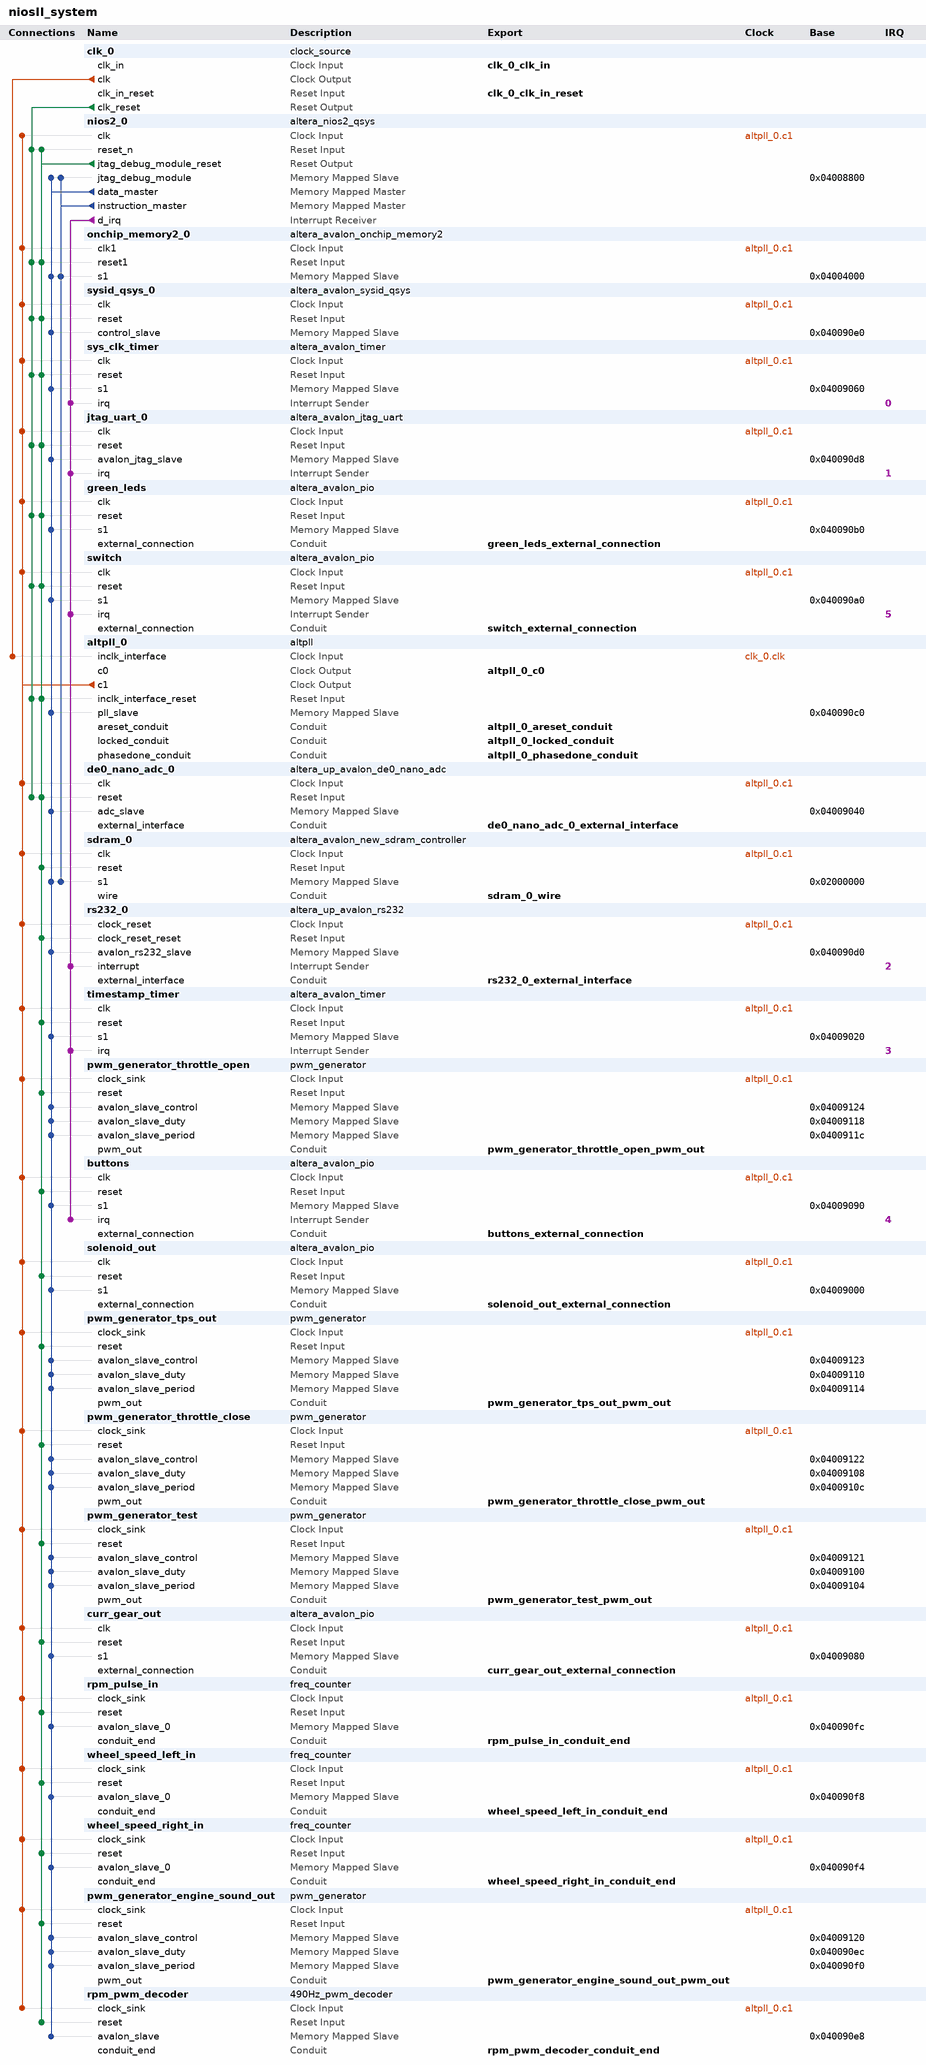
[diagram p0: system contents]
# Platform Designer (Qsys) system niosII_system, Cyclone IV E EP4CE22F17C7
# Parameters at their usual value, and those the tool derives, are not listed.
package require -exact qsys 12.1
create_system niosII_system
set_project_property DEVICE_FAMILY {Cyclone IV E}
set_project_property DEVICE EP4CE22F17C7

add_instance clk_0 clock_source 12.1
set_instance_parameter_value clk_0 clockFrequency 50000000

add_instance nios2_0 altera_nios2_qsys 12.1
set_instance_parameter_value nios2_0 resetSlave onchip_memory2_0.s1
set_instance_parameter_value nios2_0 exceptionSlave onchip_memory2_0.s1
set_instance_parameter_value nios2_0 breakSlave nios2_0.jtag_debug_module
set_instance_parameter_value nios2_0 impl Tiny
set_instance_parameter_value nios2_0 icache_size 4096

add_instance onchip_memory2_0 altera_avalon_onchip_memory2 12.1
set_instance_parameter_value onchip_memory2_0 dataWidth 32
set_instance_parameter_value onchip_memory2_0 dualPort false
set_instance_parameter_value onchip_memory2_0 initMemContent true
set_instance_parameter_value onchip_memory2_0 initializationFileName onchip_memory2_0
set_instance_parameter_value onchip_memory2_0 memorySize 16384

add_instance sysid_qsys_0 altera_avalon_sysid_qsys 12.1
set_instance_parameter_value sysid_qsys_0 id 0

add_instance sys_clk_timer altera_avalon_timer 12.1
set_instance_parameter_value sys_clk_timer period 1
set_instance_parameter_value sys_clk_timer periodUnits MSEC
set_instance_parameter_value sys_clk_timer timerPreset CUSTOM

add_instance jtag_uart_0 altera_avalon_jtag_uart 12.1
set_instance_parameter_value jtag_uart_0 simInteractiveOptions INTERACTIVE_INPUT_OUTPUT

add_instance green_leds altera_avalon_pio 12.1
set_instance_parameter_value green_leds direction Output
set_instance_parameter_value green_leds width 8

add_instance switch altera_avalon_pio 12.1
set_instance_parameter_value switch bitClearingEdgeCapReg true
set_instance_parameter_value switch captureEdge true
set_instance_parameter_value switch direction Input
set_instance_parameter_value switch generateIRQ true
set_instance_parameter_value switch irqType EDGE
set_instance_parameter_value switch width 4

add_instance altpll_0 altpll 12.1
set_instance_parameter_value altpll_0 INCLK0_INPUT_FREQUENCY 20000
set_instance_parameter_value altpll_0 GATE_LOCK_SIGNAL NO
set_instance_parameter_value altpll_0 VALID_LOCK_MULTIPLIER 1
set_instance_parameter_value altpll_0 INVALID_LOCK_MULTIPLIER 5
set_instance_parameter_value altpll_0 CLK0_MULTIPLY_BY 1
set_instance_parameter_value altpll_0 CLK1_MULTIPLY_BY 1
set_instance_parameter_value altpll_0 CLK0_DIVIDE_BY 1
set_instance_parameter_value altpll_0 CLK1_DIVIDE_BY 1
set_instance_parameter_value altpll_0 CLK0_PHASE_SHIFT -3000
set_instance_parameter_value altpll_0 CLK1_PHASE_SHIFT 0
set_instance_parameter_value altpll_0 CLK1_DUTY_CYCLE 50
set_instance_parameter_value altpll_0 PORT_clk1 PORT_USED
set_instance_parameter_value altpll_0 PORT_clk2 PORT_UNUSED
set_instance_parameter_value altpll_0 PORT_clk3 PORT_UNUSED
set_instance_parameter_value altpll_0 PORT_ARESET PORT_UNUSED
set_instance_parameter_value altpll_0 PORT_LOCKED PORT_UNUSED

add_instance de0_nano_adc_0 altera_up_avalon_de0_nano_adc 12.0
set_instance_parameter_value de0_nano_adc_0 sclk_freq 3.2
set_instance_parameter_value de0_nano_adc_0 numch 4

add_instance sdram_0 altera_avalon_new_sdram_controller 12.1
set_instance_parameter_value sdram_0 TAC 5.5
set_instance_parameter_value sdram_0 TRCD 20.0
set_instance_parameter_value sdram_0 TRP 20.0
set_instance_parameter_value sdram_0 casLatency 3
set_instance_parameter_value sdram_0 columnWidth 9
set_instance_parameter_value sdram_0 dataWidth 16
set_instance_parameter_value sdram_0 generateSimulationModel false
set_instance_parameter_value sdram_0 model custom
set_instance_parameter_value sdram_0 numberOfBanks 4
set_instance_parameter_value sdram_0 numberOfChipSelects 1
set_instance_parameter_value sdram_0 powerUpDelay 100.0
set_instance_parameter_value sdram_0 refreshPeriod 15.625
set_instance_parameter_value sdram_0 rowWidth 13

add_instance rs232_0 altera_up_avalon_rs232 12.0
set_instance_parameter_value rs232_0 baud 115200
set_instance_parameter_value rs232_0 parity None

add_instance timestamp_timer altera_avalon_timer 12.1
set_instance_parameter_value timestamp_timer period 1
set_instance_parameter_value timestamp_timer periodUnits USEC
set_instance_parameter_value timestamp_timer timerPreset CUSTOM

add_instance pwm_generator_throttle_open pwm_generator 1.0

add_instance buttons altera_avalon_pio 12.1
set_instance_parameter_value buttons captureEdge true
set_instance_parameter_value buttons direction Input
set_instance_parameter_value buttons edgeType FALLING
set_instance_parameter_value buttons generateIRQ true
set_instance_parameter_value buttons irqType EDGE
set_instance_parameter_value buttons width 8

add_instance solenoid_out altera_avalon_pio 12.1
set_instance_parameter_value solenoid_out bitModifyingOutReg true
set_instance_parameter_value solenoid_out direction Output
set_instance_parameter_value solenoid_out width 8

add_instance pwm_generator_tps_out pwm_generator 1.0

add_instance pwm_generator_throttle_close pwm_generator 1.0

add_instance pwm_generator_test pwm_generator 1.0

add_instance curr_gear_out altera_avalon_pio 12.1
set_instance_parameter_value curr_gear_out direction Output
set_instance_parameter_value curr_gear_out width 8

add_instance rpm_pulse_in freq_counter 1.0

add_instance wheel_speed_left_in freq_counter 1.0

add_instance wheel_speed_right_in freq_counter 1.0

add_instance pwm_generator_engine_sound_out pwm_generator 1.0

add_instance rpm_pwm_decoder 490Hz_pwm_decoder 1.0

# connections
add_connection altpll_0.c1 buttons.clk clock
add_connection altpll_0.c1 curr_gear_out.clk clock
add_connection altpll_0.c1 de0_nano_adc_0.clk clock
add_connection altpll_0.c1 green_leds.clk clock
add_connection altpll_0.c1 jtag_uart_0.clk clock
add_connection altpll_0.c1 nios2_0.clk clock
add_connection altpll_0.c1 onchip_memory2_0.clk1 clock
add_connection altpll_0.c1 pwm_generator_engine_sound_out.clock_sink clock
add_connection altpll_0.c1 pwm_generator_test.clock_sink clock
add_connection altpll_0.c1 pwm_generator_throttle_close.clock_sink clock
add_connection altpll_0.c1 pwm_generator_throttle_open.clock_sink clock
add_connection altpll_0.c1 pwm_generator_tps_out.clock_sink clock
add_connection altpll_0.c1 rpm_pulse_in.clock_sink clock
add_connection altpll_0.c1 rpm_pwm_decoder.clock_sink clock
add_connection altpll_0.c1 rs232_0.clock_reset clock
add_connection altpll_0.c1 sdram_0.clk clock
add_connection altpll_0.c1 solenoid_out.clk clock
add_connection altpll_0.c1 switch.clk clock
add_connection altpll_0.c1 sys_clk_timer.clk clock
add_connection altpll_0.c1 sysid_qsys_0.clk clock
add_connection altpll_0.c1 timestamp_timer.clk clock
add_connection altpll_0.c1 wheel_speed_left_in.clock_sink clock
add_connection altpll_0.c1 wheel_speed_right_in.clock_sink clock
add_connection clk_0.clk altpll_0.inclk_interface clock
add_connection clk_0.clk_reset altpll_0.inclk_interface_reset reset
add_connection clk_0.clk_reset de0_nano_adc_0.reset reset
add_connection clk_0.clk_reset green_leds.reset reset
add_connection clk_0.clk_reset jtag_uart_0.reset reset
add_connection clk_0.clk_reset nios2_0.reset_n reset
add_connection clk_0.clk_reset onchip_memory2_0.reset1 reset
add_connection clk_0.clk_reset switch.reset reset
add_connection clk_0.clk_reset sys_clk_timer.reset reset
add_connection clk_0.clk_reset sysid_qsys_0.reset reset
add_connection nios2_0.jtag_debug_module_reset altpll_0.inclk_interface_reset reset
add_connection nios2_0.jtag_debug_module_reset buttons.reset reset
add_connection nios2_0.jtag_debug_module_reset curr_gear_out.reset reset
add_connection nios2_0.jtag_debug_module_reset de0_nano_adc_0.reset reset
add_connection nios2_0.jtag_debug_module_reset green_leds.reset reset
add_connection nios2_0.jtag_debug_module_reset jtag_uart_0.reset reset
add_connection nios2_0.jtag_debug_module_reset nios2_0.reset_n reset
add_connection nios2_0.jtag_debug_module_reset onchip_memory2_0.reset1 reset
add_connection nios2_0.jtag_debug_module_reset pwm_generator_engine_sound_out.reset reset
add_connection nios2_0.jtag_debug_module_reset pwm_generator_test.reset reset
add_connection nios2_0.jtag_debug_module_reset pwm_generator_throttle_close.reset reset
add_connection nios2_0.jtag_debug_module_reset pwm_generator_throttle_open.reset reset
add_connection nios2_0.jtag_debug_module_reset pwm_generator_tps_out.reset reset
add_connection nios2_0.jtag_debug_module_reset rpm_pulse_in.reset reset
add_connection nios2_0.jtag_debug_module_reset rpm_pwm_decoder.reset reset
add_connection nios2_0.jtag_debug_module_reset rs232_0.clock_reset_reset reset
add_connection nios2_0.jtag_debug_module_reset sdram_0.reset reset
add_connection nios2_0.jtag_debug_module_reset solenoid_out.reset reset
add_connection nios2_0.jtag_debug_module_reset switch.reset reset
add_connection nios2_0.jtag_debug_module_reset sys_clk_timer.reset reset
add_connection nios2_0.jtag_debug_module_reset sysid_qsys_0.reset reset
add_connection nios2_0.jtag_debug_module_reset timestamp_timer.reset reset
add_connection nios2_0.jtag_debug_module_reset wheel_speed_left_in.reset reset
add_connection nios2_0.jtag_debug_module_reset wheel_speed_right_in.reset reset
add_connection nios2_0.data_master altpll_0.pll_slave avalon
set_connection_parameter_value nios2_0.data_master/altpll_0.pll_slave baseAddress 0x040090c0
add_connection nios2_0.data_master buttons.s1 avalon
set_connection_parameter_value nios2_0.data_master/buttons.s1 baseAddress 0x04009090
add_connection nios2_0.data_master curr_gear_out.s1 avalon
set_connection_parameter_value nios2_0.data_master/curr_gear_out.s1 baseAddress 0x04009080
add_connection nios2_0.data_master de0_nano_adc_0.adc_slave avalon
set_connection_parameter_value nios2_0.data_master/de0_nano_adc_0.adc_slave baseAddress 0x04009040
add_connection nios2_0.data_master green_leds.s1 avalon
set_connection_parameter_value nios2_0.data_master/green_leds.s1 baseAddress 0x040090b0
add_connection nios2_0.data_master jtag_uart_0.avalon_jtag_slave avalon
set_connection_parameter_value nios2_0.data_master/jtag_uart_0.avalon_jtag_slave baseAddress 0x040090d8
add_connection nios2_0.data_master nios2_0.jtag_debug_module avalon
set_connection_parameter_value nios2_0.data_master/nios2_0.jtag_debug_module baseAddress 0x04008800
add_connection nios2_0.data_master onchip_memory2_0.s1 avalon
set_connection_parameter_value nios2_0.data_master/onchip_memory2_0.s1 baseAddress 0x04004000
add_connection nios2_0.data_master pwm_generator_engine_sound_out.avalon_slave_control avalon
set_connection_parameter_value nios2_0.data_master/pwm_generator_engine_sound_out.avalon_slave_control baseAddress 0x04009120
add_connection nios2_0.data_master pwm_generator_engine_sound_out.avalon_slave_duty avalon
set_connection_parameter_value nios2_0.data_master/pwm_generator_engine_sound_out.avalon_slave_duty baseAddress 0x040090ec
add_connection nios2_0.data_master pwm_generator_engine_sound_out.avalon_slave_period avalon
set_connection_parameter_value nios2_0.data_master/pwm_generator_engine_sound_out.avalon_slave_period baseAddress 0x040090f0
add_connection nios2_0.data_master pwm_generator_test.avalon_slave_control avalon
set_connection_parameter_value nios2_0.data_master/pwm_generator_test.avalon_slave_control baseAddress 0x04009121
add_connection nios2_0.data_master pwm_generator_test.avalon_slave_duty avalon
set_connection_parameter_value nios2_0.data_master/pwm_generator_test.avalon_slave_duty baseAddress 0x04009100
add_connection nios2_0.data_master pwm_generator_test.avalon_slave_period avalon
set_connection_parameter_value nios2_0.data_master/pwm_generator_test.avalon_slave_period baseAddress 0x04009104
add_connection nios2_0.data_master pwm_generator_throttle_close.avalon_slave_control avalon
set_connection_parameter_value nios2_0.data_master/pwm_generator_throttle_close.avalon_slave_control baseAddress 0x04009122
add_connection nios2_0.data_master pwm_generator_throttle_close.avalon_slave_duty avalon
set_connection_parameter_value nios2_0.data_master/pwm_generator_throttle_close.avalon_slave_duty baseAddress 0x04009108
add_connection nios2_0.data_master pwm_generator_throttle_close.avalon_slave_period avalon
set_connection_parameter_value nios2_0.data_master/pwm_generator_throttle_close.avalon_slave_period baseAddress 0x0400910c
add_connection nios2_0.data_master pwm_generator_throttle_open.avalon_slave_control avalon
set_connection_parameter_value nios2_0.data_master/pwm_generator_throttle_open.avalon_slave_control baseAddress 0x04009124
add_connection nios2_0.data_master pwm_generator_throttle_open.avalon_slave_duty avalon
set_connection_parameter_value nios2_0.data_master/pwm_generator_throttle_open.avalon_slave_duty baseAddress 0x04009118
add_connection nios2_0.data_master pwm_generator_throttle_open.avalon_slave_period avalon
set_connection_parameter_value nios2_0.data_master/pwm_generator_throttle_open.avalon_slave_period baseAddress 0x0400911c
add_connection nios2_0.data_master pwm_generator_tps_out.avalon_slave_control avalon
set_connection_parameter_value nios2_0.data_master/pwm_generator_tps_out.avalon_slave_control baseAddress 0x04009123
add_connection nios2_0.data_master pwm_generator_tps_out.avalon_slave_duty avalon
set_connection_parameter_value nios2_0.data_master/pwm_generator_tps_out.avalon_slave_duty baseAddress 0x04009110
add_connection nios2_0.data_master pwm_generator_tps_out.avalon_slave_period avalon
set_connection_parameter_value nios2_0.data_master/pwm_generator_tps_out.avalon_slave_period baseAddress 0x04009114
add_connection nios2_0.data_master rpm_pulse_in.avalon_slave_0 avalon
set_connection_parameter_value nios2_0.data_master/rpm_pulse_in.avalon_slave_0 baseAddress 0x040090fc
add_connection nios2_0.data_master rpm_pwm_decoder.avalon_slave avalon
set_connection_parameter_value nios2_0.data_master/rpm_pwm_decoder.avalon_slave baseAddress 0x040090e8
add_connection nios2_0.data_master rs232_0.avalon_rs232_slave avalon
set_connection_parameter_value nios2_0.data_master/rs232_0.avalon_rs232_slave baseAddress 0x040090d0
add_connection nios2_0.data_master sdram_0.s1 avalon
set_connection_parameter_value nios2_0.data_master/sdram_0.s1 baseAddress 0x02000000
add_connection nios2_0.data_master solenoid_out.s1 avalon
set_connection_parameter_value nios2_0.data_master/solenoid_out.s1 baseAddress 0x04009000
add_connection nios2_0.data_master switch.s1 avalon
set_connection_parameter_value nios2_0.data_master/switch.s1 baseAddress 0x040090a0
add_connection nios2_0.data_master sys_clk_timer.s1 avalon
set_connection_parameter_value nios2_0.data_master/sys_clk_timer.s1 baseAddress 0x04009060
add_connection nios2_0.data_master sysid_qsys_0.control_slave avalon
set_connection_parameter_value nios2_0.data_master/sysid_qsys_0.control_slave baseAddress 0x040090e0
add_connection nios2_0.data_master timestamp_timer.s1 avalon
set_connection_parameter_value nios2_0.data_master/timestamp_timer.s1 baseAddress 0x04009020
add_connection nios2_0.data_master wheel_speed_left_in.avalon_slave_0 avalon
set_connection_parameter_value nios2_0.data_master/wheel_speed_left_in.avalon_slave_0 baseAddress 0x040090f8
add_connection nios2_0.data_master wheel_speed_right_in.avalon_slave_0 avalon
set_connection_parameter_value nios2_0.data_master/wheel_speed_right_in.avalon_slave_0 baseAddress 0x040090f4
add_connection nios2_0.instruction_master nios2_0.jtag_debug_module avalon
set_connection_parameter_value nios2_0.instruction_master/nios2_0.jtag_debug_module baseAddress 0x04008800
add_connection nios2_0.instruction_master onchip_memory2_0.s1 avalon
set_connection_parameter_value nios2_0.instruction_master/onchip_memory2_0.s1 baseAddress 0x04004000
add_connection nios2_0.instruction_master sdram_0.s1 avalon
set_connection_parameter_value nios2_0.instruction_master/sdram_0.s1 baseAddress 0x02000000
add_connection nios2_0.d_irq buttons.irq interrupt
set_connection_parameter_value nios2_0.d_irq/buttons.irq irqNumber 4
add_connection nios2_0.d_irq jtag_uart_0.irq interrupt
set_connection_parameter_value nios2_0.d_irq/jtag_uart_0.irq irqNumber 1
add_connection nios2_0.d_irq rs232_0.interrupt interrupt
set_connection_parameter_value nios2_0.d_irq/rs232_0.interrupt irqNumber 2
add_connection nios2_0.d_irq switch.irq interrupt
set_connection_parameter_value nios2_0.d_irq/switch.irq irqNumber 5
add_connection nios2_0.d_irq sys_clk_timer.irq interrupt
set_connection_parameter_value nios2_0.d_irq/sys_clk_timer.irq irqNumber 0
add_connection nios2_0.d_irq timestamp_timer.irq interrupt
set_connection_parameter_value nios2_0.d_irq/timestamp_timer.irq irqNumber 3

# exported interfaces
add_interface altpll_0_c0 clock source
set_interface_property altpll_0_c0 EXPORT_OF altpll_0.c0
add_interface altpll_0_areset_conduit conduit end
set_interface_property altpll_0_areset_conduit EXPORT_OF altpll_0.areset_conduit
add_interface altpll_0_locked_conduit conduit end
set_interface_property altpll_0_locked_conduit EXPORT_OF altpll_0.locked_conduit
add_interface clk_0_clk_in clock sink
set_interface_property clk_0_clk_in EXPORT_OF clk_0.clk_in
add_interface de0_nano_adc_0_external_interface conduit end
set_interface_property de0_nano_adc_0_external_interface EXPORT_OF de0_nano_adc_0.external_interface
add_interface altpll_0_phasedone_conduit conduit end
set_interface_property altpll_0_phasedone_conduit EXPORT_OF altpll_0.phasedone_conduit
add_interface clk_0_clk_in_reset reset sink
set_interface_property clk_0_clk_in_reset EXPORT_OF clk_0.clk_in_reset
add_interface switch_external_connection conduit end
set_interface_property switch_external_connection EXPORT_OF switch.external_connection
add_interface green_leds_external_connection conduit end
set_interface_property green_leds_external_connection EXPORT_OF green_leds.external_connection
add_interface sdram_0_wire conduit end
set_interface_property sdram_0_wire EXPORT_OF sdram_0.wire
add_interface rs232_0_external_interface conduit end
set_interface_property rs232_0_external_interface EXPORT_OF rs232_0.external_interface
add_interface buttons_external_connection conduit end
set_interface_property buttons_external_connection EXPORT_OF buttons.external_connection
add_interface solenoid_out_external_connection conduit end
set_interface_property solenoid_out_external_connection EXPORT_OF solenoid_out.external_connection
add_interface pwm_generator_tps_out_pwm_out conduit end
set_interface_property pwm_generator_tps_out_pwm_out EXPORT_OF pwm_generator_tps_out.pwm_out
add_interface pwm_generator_throttle_close_pwm_out conduit end
set_interface_property pwm_generator_throttle_close_pwm_out EXPORT_OF pwm_generator_throttle_close.pwm_out
add_interface pwm_generator_throttle_open_pwm_out conduit end
set_interface_property pwm_generator_throttle_open_pwm_out EXPORT_OF pwm_generator_throttle_open.pwm_out
add_interface pwm_generator_test_pwm_out conduit end
set_interface_property pwm_generator_test_pwm_out EXPORT_OF pwm_generator_test.pwm_out
add_interface curr_gear_out_external_connection conduit end
set_interface_property curr_gear_out_external_connection EXPORT_OF curr_gear_out.external_connection
add_interface rpm_pulse_in_conduit_end conduit end
set_interface_property rpm_pulse_in_conduit_end EXPORT_OF rpm_pulse_in.conduit_end
add_interface wheel_speed_left_in_conduit_end conduit end
set_interface_property wheel_speed_left_in_conduit_end EXPORT_OF wheel_speed_left_in.conduit_end
add_interface wheel_speed_right_in_conduit_end conduit end
set_interface_property wheel_speed_right_in_conduit_end EXPORT_OF wheel_speed_right_in.conduit_end
add_interface pwm_generator_engine_sound_out_pwm_out conduit end
set_interface_property pwm_generator_engine_sound_out_pwm_out EXPORT_OF pwm_generator_engine_sound_out.pwm_out
add_interface rpm_pwm_decoder_conduit_end conduit end
set_interface_property rpm_pwm_decoder_conduit_end EXPORT_OF rpm_pwm_decoder.conduit_end

save_system niosII_system.qsys
